# Altium project volt reg.PrjPcb
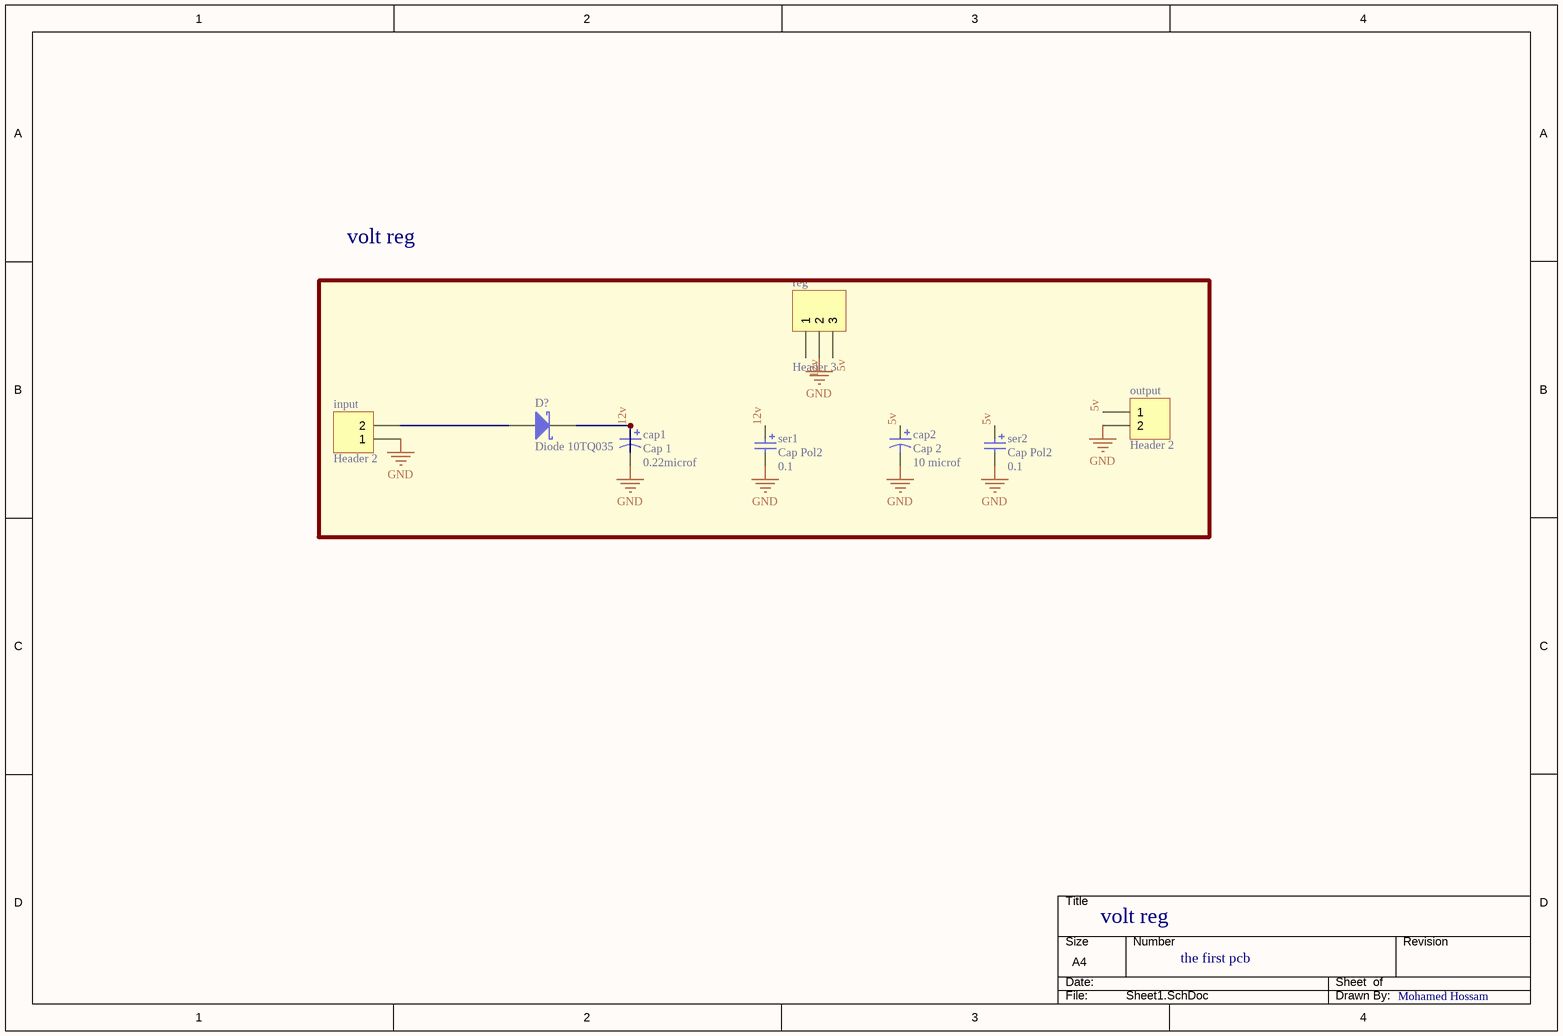
[diagram p0: Sheet1.SchDoc]
1 sheet, 8 parts. Net scope: global (net labels, ports and power ports of the same name join across sheets).
Board file: PCB1.PcbDoc

## Sheet Sheet1.SchDoc
size A4; SheetNumber: 1; SheetTotal: 1; SPICEModelCacheWSAYJCKL: <root> / <DocumentId>WSAYJCKL</DocumentId> / <CacheFrame Number="0"> / <Model Name="10tq035" Kind="MDL"> / <Text>*10TQ035 MCE 3/26/98 / *Ref: IR Power Semiconductors Product Digest '94 / *MCE 35V 10A 3us pkg:TO-220 3,1 / .MODEL 10TQ035 D (IS=14.2N RS=4.2M N=1.7 BV=35 IBV=15M / + CJO=412P VJ=0.75 M=0.333 TT=4.32U EG=.69 XTI=2)</Text> / </Model> / </CacheFrame> / </root>

### Parts
cap1  Cap 1  value 0.22microf  [RB7.6-15]
cap2  Cap 2  value 10 microf  [RB7.6-15]
D?  Diode 10TQ035  [TO-220AC]
input  Header 2  [HDR1X2]
output  Header 2  [HDR1X2]
reg  Header 3  [HDR1X3]
ser1  Cap Pol2  value 0.1  [POLAR0.8]
ser2  Cap Pol2  value 0.1  [POLAR0.8]

### Nets
GND: cap1.2 cap2.2 input.1 output.2 reg.2 ser1.2 ser2.2
5v: cap2.1 output.1 reg.3 ser2.1
12v: cap1.1 D?.1(K) reg.1 ser1.1
NetD?_3: D?.3(A) input.2

### Notes on the sheet
- volt reg
- the first pcb
- Mohamed Hossam
- THIS DOCUMENT AND THE DATA DISCLOSED HEREIN OR
- HEREWITH IS THE PROPERTY OF ALTIUM LIMITED AND MAY
- DWG NO:
- REVISION
- REV:
- DESCRIPTION
- DATE
- APPROVED
- BE FREELY DISTRIBUTED IN WHOLE. NO RIGHTS ARE
- RESERVED OR EXPRESS OR IMPLIED WARANTEE GIVEN.
- ENG:
- APPROVALS
- PROJECT
- DSN:
- CHK:
- REFERENCE DOCUMENTS
- PROJECT REVISION:
- TITLE
- DOCUMENT REVISION:
- DESIGN ITEM:
- BOM:
- FAB DWG:
- PCB DWG:
- ASSY DWG:
- SCALE:
- A3
- SIZE
- CAGE CODE
- FILE NAME
- DWG NO.
- SHEET
- OF
- REV

### Library data of the parts
cap1 cap2 = Cap Pol1: Polarized Capacitor (Radial); Published: 8-Jun-2000; LatestRevisionDate: 17-Jul-2002; LatestRevisionNote: Re-released for DXP Platform.; PackageReference: RB7.6-15; Publisher: Altium Limited; PackageDescription: Polarized Capacitor (Radial); 2 Leads
D? = Diode 10TQ035: Schottky Rectifier; Note: Terminal 2 is the TAB and is electrically connected to the cathode; Published: 8-Jun-2000; LatestRevisionDate: 17-Jul-2002; LatestRevisionNote: Re-released for DXP Platform.; DatasheetVersion: PD-2.057B; PackageVersion: Feb-1998; PackageReference: TO-220AC; Publisher: Altium Limited; PackageDescription: TO, Thru-Hole, Vertical, Heatsink Mounted; 3 In-Line Leads (1 Absent); Pitch 2.54 mm; ComponentLink1Description: Manufacturer Link; ComponentLink1URL: http://www.irf.com/; ComponentLink2Description: Datasheet; ComponentLink2URL: http://www.irf.com/product-info/datasheets/data/10tq.pdf
input output = Header 2: Header, 2-Pin; LatestRevisionDate: 17-Jul-2002; LatestRevisionNote: Re-released for DXP Platform.; Publisher: Altium Limited
reg = Header 3: Header, 3-Pin; LatestRevisionDate: 17-Jul-2002; LatestRevisionNote: Re-released for DXP Platform.; Publisher: Altium Limited
ser1 ser2 = Cap Pol2: Polarized Capacitor (Axial); Published: 8-Jun-2000; LatestRevisionDate: 17-Jul-2002; LatestRevisionNote: Re-released for DXP Platform.; PackageReference: POLAR0.8; Publisher: Altium Limited; PackageDescription: Polarized Capacitor; 2 Leads